# Altium schematic sheet [05] - NIXIE.SchDoc
size A3; DocumentNumber: 5; SheetNumber: 5; SheetTotal: 6
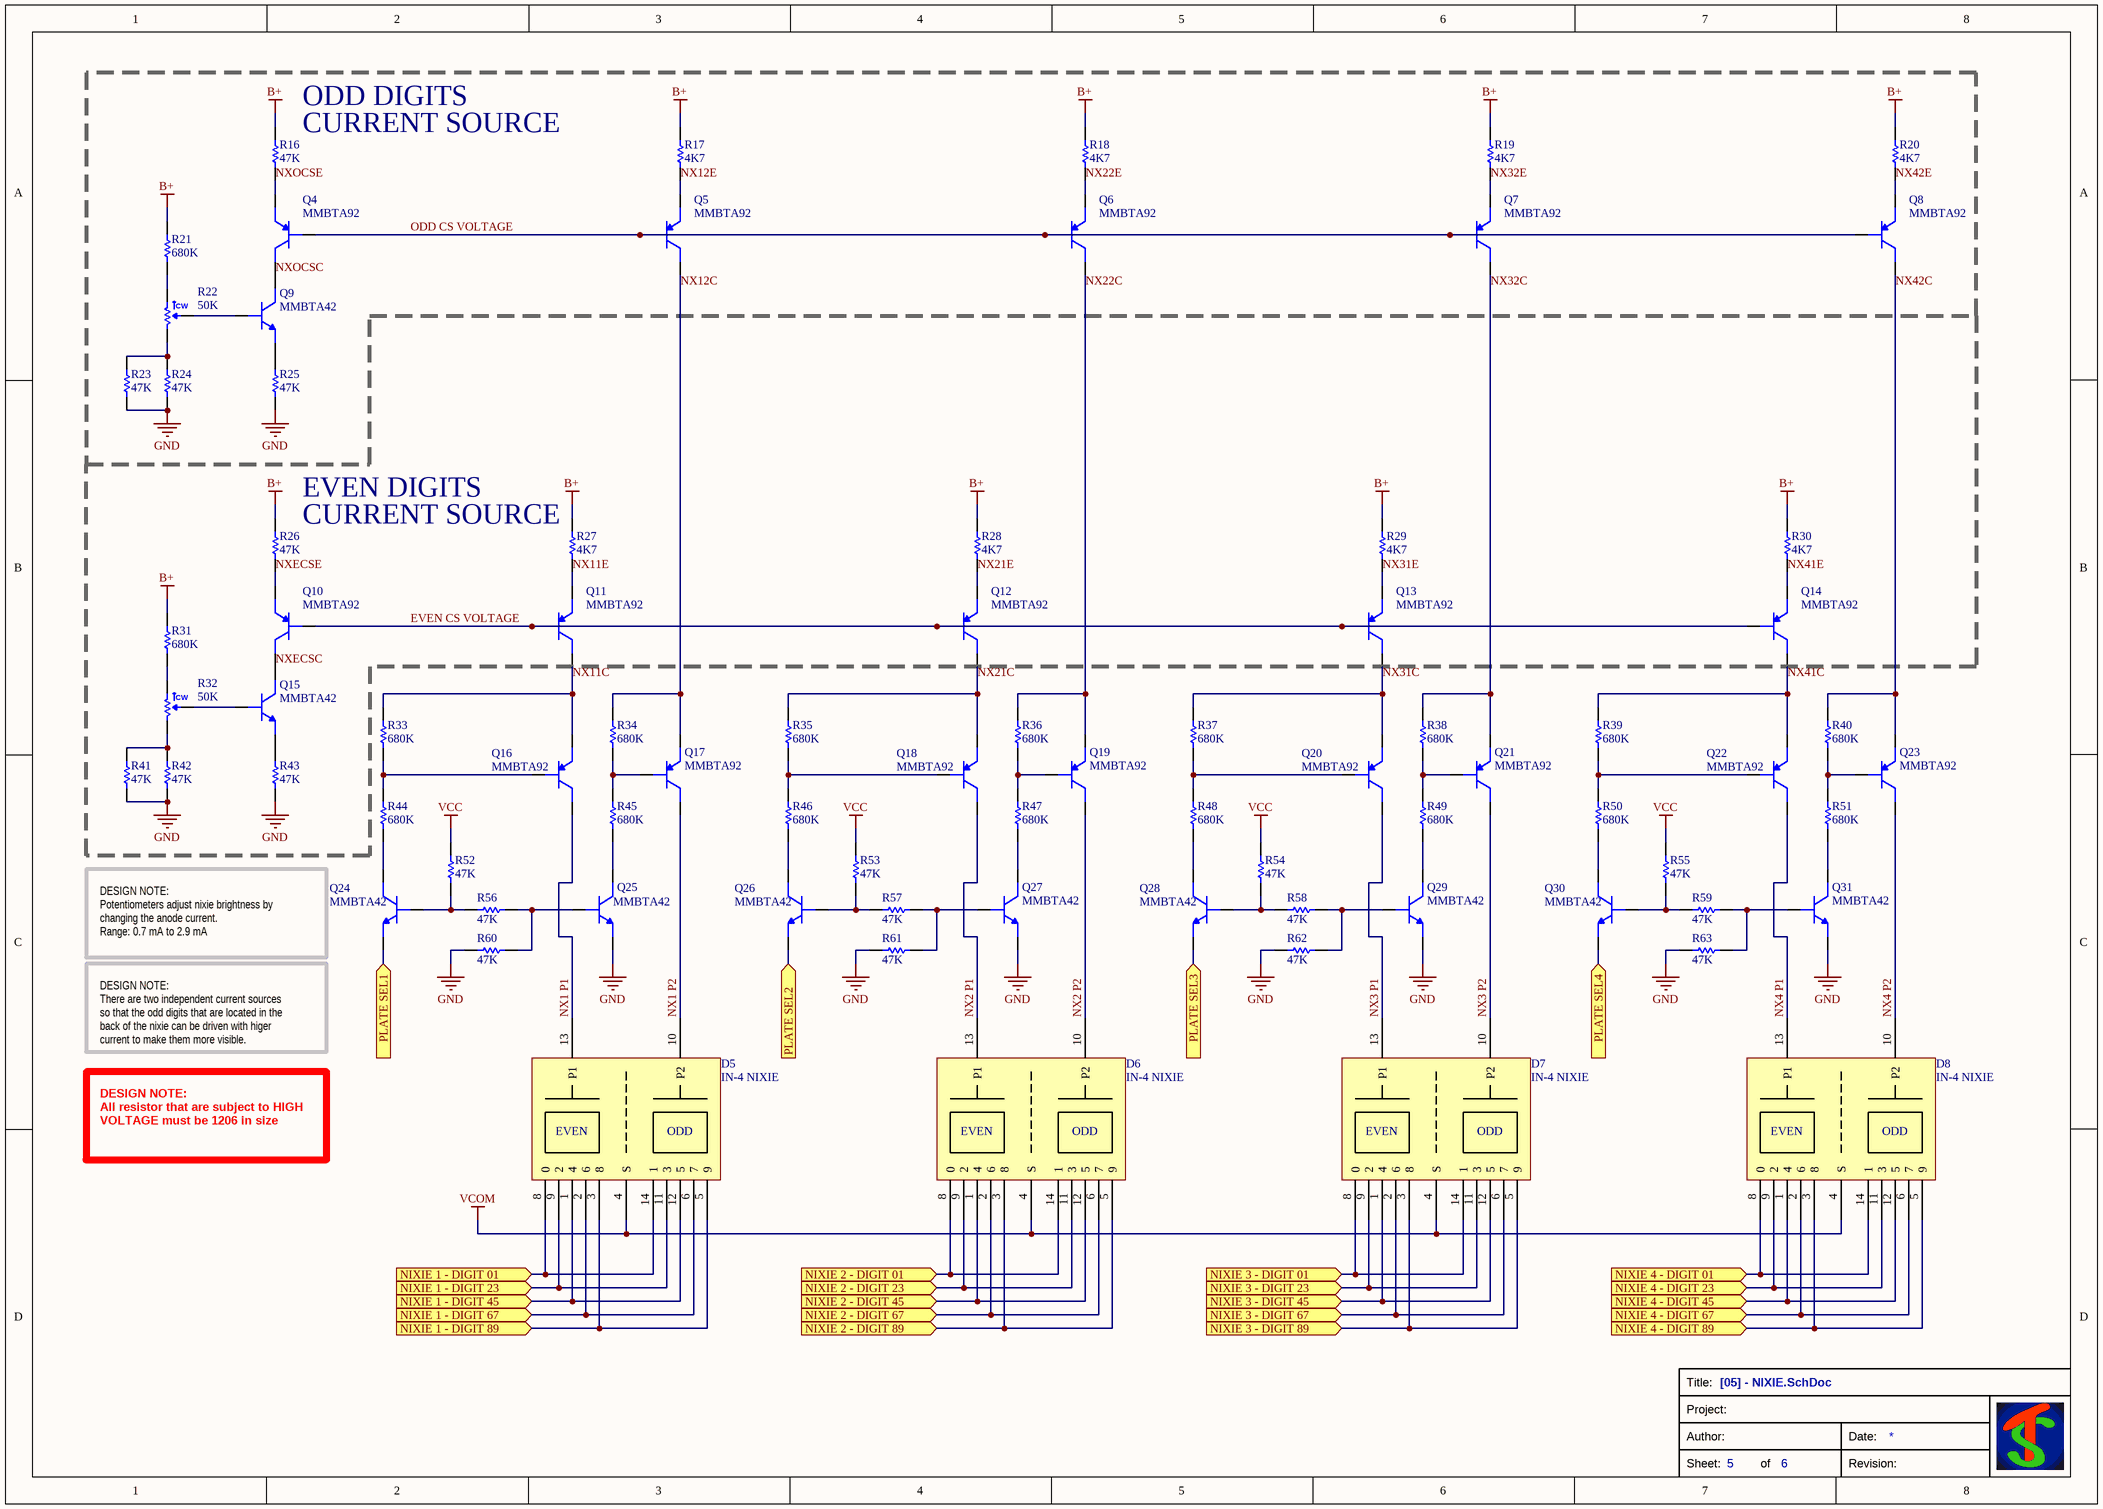
[diagram p0: [05] - NIXIE.SchDoc]

## Parts
D5  IN-4 NIXIE  [IN4 NIXIE]
D6  IN-4 NIXIE  [IN4 NIXIE]
D7  IN-4 NIXIE  [IN4 NIXIE]
D8  IN-4 NIXIE  [IN4 NIXIE]
Q4  MMBTA92  [SOT95P240X110-3N]
Q5  MMBTA92  [SOT95P240X110-3N]
Q6  MMBTA92  [SOT95P240X110-3N]
Q7  MMBTA92  [SOT95P240X110-3N]
Q8  MMBTA92  [SOT95P240X110-3N]
Q9  MMBTA42  [SOT95P240X110-3N]
Q10  MMBTA92  [SOT95P240X110-3N]
Q11  MMBTA92  [SOT95P240X110-3N]
Q12  MMBTA92  [SOT95P240X110-3N]
Q13  MMBTA92  [SOT95P240X110-3N]
Q14  MMBTA92  [SOT95P240X110-3N]
Q15  MMBTA42  [SOT95P240X110-3N]
Q16  MMBTA92  [SOT95P240X110-3N]
Q17  MMBTA92  [SOT95P240X110-3N]
Q18  MMBTA92  [SOT95P240X110-3N]
Q19  MMBTA92  [SOT95P240X110-3N]
Q20  MMBTA92  [SOT95P240X110-3N]
Q21  MMBTA92  [SOT95P240X110-3N]
Q22  MMBTA92  [SOT95P240X110-3N]
Q23  MMBTA92  [SOT95P240X110-3N]
Q24  MMBTA42  [SOT95P240X110-3N]
Q25  MMBTA42  [SOT95P240X110-3N]
Q26  MMBTA42  [SOT95P240X110-3N]
Q27  MMBTA42  [SOT95P240X110-3N]
Q28  MMBTA42  [SOT95P240X110-3N]
Q29  MMBTA42  [SOT95P240X110-3N]
Q30  MMBTA42  [SOT95P240X110-3N]
Q31  MMBTA42  [SOT95P240X110-3N]
R16  value 47K  [RES-0805]  (hidden comment: RT0805FRE0747KL)
R17  value 4K7  [RES-0805]  (hidden comment: RT0805FRE134K7L)
R18  value 4K7  [RES-0805]  (hidden comment: RT0805FRE134K7L)
R19  value 4K7  [RES-0805]  (hidden comment: RT0805FRE134K7L)
R20  value 4K7  [RES-0805]  (hidden comment: RT0805FRE134K7L)
R21  value 680K  [RES-1206]  (hidden comment: RT1206FRE07680KL)
R22  value 50K  [TC33X2503E]  (hidden comment: ODD)
R23  value 47K  [RES-0805]  (hidden comment: RT0805FRE0747KL)
R24  value 47K  [RES-0805]  (hidden comment: RT0805FRE0747KL)
R25  value 47K  [RES-0805]  (hidden comment: RT0805FRE0747KL)
R26  value 47K  [RES-0805]  (hidden comment: RT0805FRE0747KL)
R27  value 4K7  [RES-0805]  (hidden comment: RT0805FRE134K7L)
R28  value 4K7  [RES-0805]  (hidden comment: RT0805FRE134K7L)
R29  value 4K7  [RES-0805]  (hidden comment: RT0805FRE134K7L)
R30  value 4K7  [RES-0805]  (hidden comment: RT0805FRE134K7L)
R31  value 680K  [RES-1206]  (hidden comment: RT1206FRE07680KL)
R32  value 50K  [TC33X2503E]  (hidden comment: EVEN)
R33  value 680K  [RES-1206]  (hidden comment: RT1206FRE07680KL)
R34  value 680K  [RES-1206]  (hidden comment: RT1206FRE07680KL)
R35  value 680K  [RES-1206]  (hidden comment: RT1206FRE07680KL)
R36  value 680K  [RES-1206]  (hidden comment: RT1206FRE07680KL)
R37  value 680K  [RES-1206]  (hidden comment: RT1206FRE07680KL)
R38  value 680K  [RES-1206]  (hidden comment: RT1206FRE07680KL)
R39  value 680K  [RES-1206]  (hidden comment: RT1206FRE07680KL)
R40  value 680K  [RES-1206]  (hidden comment: RT1206FRE07680KL)
R41  value 47K  [RES-0805]  (hidden comment: RT0805FRE0747KL)
R42  value 47K  [RES-0805]  (hidden comment: RT0805FRE0747KL)
R43  value 47K  [RES-0805]  (hidden comment: RT0805FRE0747KL)
R44  value 680K  [RES-1206]  (hidden comment: RT1206FRE07680KL)
R45  value 680K  [RES-1206]  (hidden comment: RT1206FRE07680KL)
R46  value 680K  [RES-1206]  (hidden comment: RT1206FRE07680KL)
R47  value 680K  [RES-1206]  (hidden comment: RT1206FRE07680KL)
R48  value 680K  [RES-1206]  (hidden comment: RT1206FRE07680KL)
R49  value 680K  [RES-1206]  (hidden comment: RT1206FRE07680KL)
R50  value 680K  [RES-1206]  (hidden comment: RT1206FRE07680KL)
R51  value 680K  [RES-1206]  (hidden comment: RT1206FRE07680KL)
R52  value 47K  [RES-0805]  (hidden comment: RT0805FRE0747KL)
R53  value 47K  [RES-0805]  (hidden comment: RT0805FRE0747KL)
R54  value 47K  [RES-0805]  (hidden comment: RT0805FRE0747KL)
R55  value 47K  [RES-0805]  (hidden comment: RT0805FRE0747KL)
R56  value 47K  [RES-0805]  (hidden comment: RT0805FRE0747KL)
R57  value 47K  [RES-0805]  (hidden comment: RT0805FRE0747KL)
R58  value 47K  [RES-0805]  (hidden comment: RT0805FRE0747KL)
R59  value 47K  [RES-0805]  (hidden comment: RT0805FRE0747KL)
R60  value 47K  [RES-0805]  (hidden comment: RT0805FRE0747KL)
R61  value 47K  [RES-0805]  (hidden comment: RT0805FRE0747KL)
R62  value 47K  [RES-0805]  (hidden comment: RT0805FRE0747KL)
R63  value 47K  [RES-0805]  (hidden comment: RT0805FRE0747KL)

## Ports
NIXIE 1 - DIGIT 01 (in), NIXIE 1 - DIGIT 23 (in), NIXIE 1 - DIGIT 45 (in), NIXIE 1 - DIGIT 67 (in), NIXIE 1 - DIGIT 89 (in), NIXIE 2 - DIGIT 01 (in), NIXIE 2 - DIGIT 23 (in), NIXIE 2 - DIGIT 45 (in), NIXIE 2 - DIGIT 67 (in), NIXIE 2 - DIGIT 89 (in), NIXIE 3 - DIGIT 01 (in), NIXIE 3 - DIGIT 23 (in), NIXIE 3 - DIGIT 45 (in), NIXIE 3 - DIGIT 67 (in), NIXIE 3 - DIGIT 89 (in), NIXIE 4 - DIGIT 01 (in), NIXIE 4 - DIGIT 23 (in), NIXIE 4 - DIGIT 45 (in), NIXIE 4 - DIGIT 67 (in), NIXIE 4 - DIGIT 89 (in), PLATE SEL1 (in), PLATE SEL2 (in), PLATE SEL3 (in), PLATE SEL4 (in)

## Nets
B+: R16.2 R17.2 R18.2 R19.2 R20.2 R21.2 R26.2 R27.2 R28.2 R29.2 R30.2 R31.2
GND: Q25.2(E) Q27.2(E) Q29.2(E) Q31.2(E) R23.1 R24.1 R25.1 R41.1 R42.1 R43.1 R60.2 R61.2 R62.2 R63.2
VCC: R52.2 R53.2 R54.2 R55.2
VCOM: D5.4(S) D6.4(S) D7.4(S) D8.4(S)
EVEN CS VOLTAGE: Q10.1(B) Q11.1(B) Q12.1(B) Q13.1(B) Q14.1(B)
NIXIE 1 - DIGIT 01: D5.8(0) D5.14(1) ; port NIXIE 1 - DIGIT 01
NIXIE 1 - DIGIT 23: D5.9(2) D5.11(3) ; port NIXIE 1 - DIGIT 23
NIXIE 1 - DIGIT 45: D5.1(4) D5.12(5) ; port NIXIE 1 - DIGIT 45
NIXIE 1 - DIGIT 67: D5.2(6) D5.6(7) ; port NIXIE 1 - DIGIT 67
NIXIE 1 - DIGIT 89: D5.3(8) D5.5(9) ; port NIXIE 1 - DIGIT 89
NIXIE 2 - DIGIT 01: D6.8(0) D6.14(1) ; port NIXIE 2 - DIGIT 01
NIXIE 2 - DIGIT 23: D6.9(2) D6.11(3) ; port NIXIE 2 - DIGIT 23
NIXIE 2 - DIGIT 45: D6.1(4) D6.12(5) ; port NIXIE 2 - DIGIT 45
NIXIE 2 - DIGIT 67: D6.2(6) D6.6(7) ; port NIXIE 2 - DIGIT 67
NIXIE 2 - DIGIT 89: D6.3(8) D6.5(9) ; port NIXIE 2 - DIGIT 89
NIXIE 3 - DIGIT 01: D7.8(0) D7.14(1) ; port NIXIE 3 - DIGIT 01
NIXIE 3 - DIGIT 23: D7.9(2) D7.11(3) ; port NIXIE 3 - DIGIT 23
NIXIE 3 - DIGIT 45: D7.1(4) D7.12(5) ; port NIXIE 3 - DIGIT 45
NIXIE 3 - DIGIT 67: D7.2(6) D7.6(7) ; port NIXIE 3 - DIGIT 67
NIXIE 3 - DIGIT 89: D7.3(8) D7.5(9) ; port NIXIE 3 - DIGIT 89
NIXIE 4 - DIGIT 01: D8.8(0) D8.14(1) ; port NIXIE 4 - DIGIT 01
NIXIE 4 - DIGIT 23: D8.9(2) D8.11(3) ; port NIXIE 4 - DIGIT 23
NIXIE 4 - DIGIT 45: D8.1(4) D8.12(5) ; port NIXIE 4 - DIGIT 45
NIXIE 4 - DIGIT 67: D8.2(6) D8.6(7) ; port NIXIE 4 - DIGIT 67
NIXIE 4 - DIGIT 89: D8.3(8) D8.5(9) ; port NIXIE 4 - DIGIT 89
NX1 P1: D5.13(P1) Q16.3(C)
NX1 P2: D5.10(P2) Q17.3(C)
NX2 P1: D6.13(P1) Q18.3(C)
NX2 P2: D6.10(P2) Q19.3(C)
NX3 P1: D7.13(P1) Q20.3(C)
NX3 P2: D7.10(P2) Q21.3(C)
NX4 P1: D8.13(P1) Q22.3(C)
NX4 P2: D8.10(P2) Q23.3(C)
NX11C: Q11.3(C) Q16.2(E) R33.2
NX11E: Q11.2(E) R27.1
NX12C: Q5.3(C) Q17.2(E) R34.2
NX12E: Q5.2(E) R17.1
NX21C: Q12.3(C) Q18.2(E) R35.2
NX21E: Q12.2(E) R28.1
NX22C: Q6.3(C) Q19.2(E) R36.2
NX22E: Q6.2(E) R18.1
NX31C: Q13.3(C) Q20.2(E) R37.2
NX31E: Q13.2(E) R29.1
NX32C: Q7.3(C) Q21.2(E) R38.2
NX32E: Q7.2(E) R19.1
NX41C: Q14.3(C) Q22.2(E) R39.2
NX41E: Q14.2(E) R30.1
NX42C: Q8.3(C) Q23.2(E) R40.2
NX42E: Q8.2(E) R20.1
NXECSC: Q10.3(C) Q15.3(C)
NXECSE: Q10.2(E) R26.1
NXOCSC: Q4.3(C) Q9.3(C)
NXOCSE: Q4.2(E) R16.1
ODD CS VOLTAGE: Q4.1(B) Q5.1(B) Q6.1(B) Q7.1(B) Q8.1(B)
PLATE SEL1: Q24.2(E) ; port PLATE SEL1
PLATE SEL2: Q26.2(E) ; port PLATE SEL2
PLATE SEL3: Q28.2(E) ; port PLATE SEL3
PLATE SEL4: Q30.2(E) ; port PLATE SEL4
NetQ9_1: Q9.1(B) R22.2
NetQ9_2: Q9.2(E) R25.2
NetQ15_1: Q15.1(B) R32.2
NetQ15_2: Q15.2(E) R43.2
NetQ16_1: Q16.1(B) R33.1 R44.2
NetQ17_1: Q17.1(B) R34.1 R45.2
NetQ18_1: Q18.1(B) R35.1 R46.2
NetQ19_1: Q19.1(B) R36.1 R47.2
NetQ20_1: Q20.1(B) R37.1 R48.2
NetQ21_1: Q21.1(B) R38.1 R49.2
NetQ22_1: Q22.1(B) R39.1 R50.2
NetQ23_1: Q23.1(B) R40.1 R51.2
NetQ24_1: Q24.1(B) R52.1 R56.2
NetQ24_3: Q24.3(C) R44.1
NetQ25_1: Q25.1(B) R56.1 R60.1
NetQ25_3: Q25.3(C) R45.1
NetQ26_1: Q26.1(B) R53.1 R57.2
NetQ26_3: Q26.3(C) R46.1
NetQ27_1: Q27.1(B) R57.1 R61.1
NetQ27_3: Q27.3(C) R47.1
NetQ28_1: Q28.1(B) R54.1 R58.2
NetQ28_3: Q28.3(C) R48.1
NetQ29_1: Q29.1(B) R58.1 R62.1
NetQ29_3: Q29.3(C) R49.1
NetQ30_1: Q30.1(B) R55.1 R59.2
NetQ30_3: Q30.3(C) R50.1
NetQ31_1: Q31.1(B) R59.1 R63.1
NetQ31_3: Q31.3(C) R51.1
NetR21_1: R21.1 R22.3
NetR22_1: R22.1 R23.2 R24.2
NetR31_1: R31.1 R32.3
NetR32_1: R32.1 R41.2 R42.2

## Notes on the sheet
- (near R16) ODD DIGITS
- (near R16) CURRENT SOURCE
- (near R26) EVEN DIGITS
- (near R26) CURRENT SOURCE
- DESIGN NOTE:
  Potentiometers adjust nixie brightness by changing the anode current.
  Range: 0.7 mA to 2.9 mA
- DESIGN NOTE:
  There are two independent current sources so that the odd digits that are located in the back of the nixie can be driven with higer current to make them more visible.
- DESIGN NOTE:
  All resistor that are subject to HIGH VOLTAGE must be 1206 in size
- Title:
- Project:
- Sheet:
- Author:
- of
- Revision:
- Date:
- (in symbol IN-4 NIXIE) EVEN; ODD
- (in symbol POT-50K-TC33X-2-503E) CW

## Library data of the parts
Q4-Q8 Q10-Q14 Q16-Q23 = PNP-MMBTA92: 300V PNP SMALL SIGNAL TRANSISTOR IN SOT23; Supplier 1: Mouser; Supplier Part Number 1: 621-MMBTA92-F
Q9 Q15 Q24-Q31 = NPN-MMBTA42: 300V NPN SMALL SIGNAL TRANSISTOR IN SOT23; Supplier 1: Mouser; Supplier Part Number 1: 621-MMBTA42-F
R16 R23-R26 R41-R43 R52-R63 = RES-0805-47K-RT0805FRE0747KL: Thin Film Resistors 1/8W 47K ohm 1% 50ppm; Manufacturer: Yageo; Power Rating: 1/10W; Voltage Rating: 75V; Tolerance: 1%; Supplier 1: Mouser; Supplier Part Number 1: 603-RT0805FRE0747KL
R17-R20 R27-R30 = RES-0805-4K7-RT0805FRE134K7L: Thin Film Resistors 4.7K ohm 1% 50 ppm; Manufacturer: Yageo; Power Rating: 1/10W; Voltage Rating: 75V; Tolerance: 1%; Supplier 1: Mouser; Supplier Part Number 1: 603-RT0805FRE134K7L
R21 R31 R33-R40 R44-R51 = RES-1206-680K-RT1206FRE07680KL: Thin Film Resistors 680K OHM 1% 50PPM 1/4W; Manufacturer: Yageo; Power Rating: 1/10W; Voltage Rating: 75V; Tolerance: 1%; Supplier 1: Mouser; Supplier Part Number 1: 603-RT1206FRE07680KL
R22 R32 = POT-50K-TC33X-2-503E: Resistenze trimmer - SMD 3MM 50KOHMS 25% 0.1WATT OPEN FRM; Manufacturer: Yageo; Power Rating: 1/10W; Voltage Rating: 75V; Tolerance: 1%; Supplier 1: Mouser; Supplier Part Number 1: 652-TC33X-2-503E